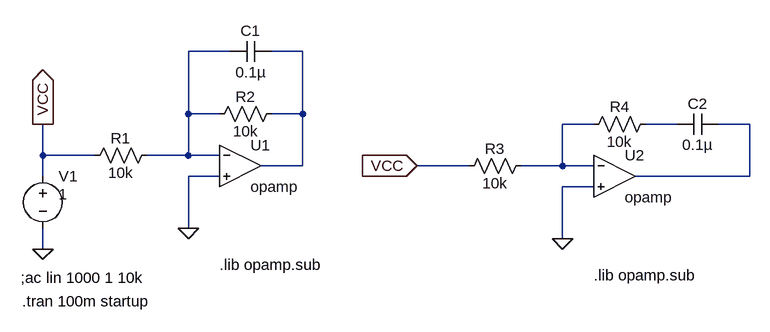
[diagram p0: schematic Operationsverstärker.asc]
Operationsverstärker.asc, the LTspice schematic file:
Version 4
SHEET 1 1028 680
WIRE 224 -16 160 -16
WIRE 336 -16 288 -16
WIRE 160 80 160 -16
WIRE 208 80 160 80
WIRE 336 80 336 -16
WIRE 336 80 288 80
WIRE 784 96 736 96
WIRE 912 96 864 96
WIRE 1024 96 976 96
WIRE -64 144 -64 96
WIRE 16 144 -64 144
WIRE 160 144 160 80
WIRE 160 144 96 144
WIRE 208 144 160 144
WIRE 336 160 336 80
WIRE 336 160 272 160
WIRE 592 160 512 160
WIRE 736 160 736 96
WIRE 736 160 672 160
WIRE 784 160 736 160
WIRE -64 176 -64 144
WIRE 208 176 160 176
WIRE 1024 176 1024 96
WIRE 1024 176 848 176
WIRE 784 192 736 192
WIRE 160 256 160 176
WIRE 736 272 736 192
WIRE -64 288 -64 256
FLAG 160 256 0
FLAG -64 288 0
FLAG 736 272 0
FLAG -64 96 VCC
IOPIN -64 96 Out
FLAG 512 160 VCC
IOPIN 512 160 In
SYMBOL res 112 128 R90
WINDOW 0 5 56 VBottom 2
WINDOW 3 27 56 VTop 2
SYMATTR InstName R1
SYMATTR Value 10k
SYMBOL res 304 64 R90
WINDOW 0 5 56 VBottom 2
WINDOW 3 27 56 VTop 2
SYMATTR InstName R2
SYMATTR Value 10k
SYMBOL cap 288 -32 R90
WINDOW 0 0 32 VBottom 2
WINDOW 3 32 32 VTop 2
SYMATTR InstName C1
SYMATTR Value 0.1µ
SYMBOL Opamps\\opamp 240 96 R0
SYMATTR InstName U1
SYMBOL voltage -64 160 R0
WINDOW 3 24 44 Left 2
WINDOW 123 24 180 Left 2
WINDOW 39 0 0 Left 2
SYMATTR InstName V1
SYMATTR Value 1
SYMBOL res 688 144 R90
WINDOW 0 5 56 VBottom 2
WINDOW 3 27 56 VTop 2
SYMATTR InstName R3
SYMATTR Value 10k
SYMBOL res 880 80 R90
WINDOW 0 5 56 VBottom 2
WINDOW 3 27 56 VTop 2
SYMATTR InstName R4
SYMATTR Value 10k
SYMBOL cap 976 80 R90
WINDOW 0 0 32 VBottom 2
WINDOW 3 32 32 VTop 2
SYMATTR InstName C2
SYMATTR Value 0.1µ
SYMBOL Opamps\\opamp 816 112 R0
SYMATTR InstName U2
TEXT 208 312 Left 2 !.lib opamp.sub
TEXT -98 332 Left 2 !;ac lin 1000 1 10k
TEXT -96 368 Left 2 !.tran 100m startup
TEXT 784 328 Left 2 !.lib opamp.sub

The netlist it stands for:
* Operationsverstärker.asc
R1 N001 VCC 10k
R2 N002 N001 10k
C1 N002 N001 0.1µ
XU1 N001 0 N002 opamp Aol=100K GBW=10Meg  ; pins invin noninvin out
V1 VCC 0 1
R3 N003 VCC 10k
R4 N004 N003 10k
C2 N005 N004 0.1µ
XU2 N003 0 N005 opamp Aol=100K GBW=10Meg  ; pins invin noninvin out
.lib opamp.sub
;ac lin 1000 1 10k
.tran 100m startup
.lib opamp.sub
.backanno
.end